# Altium schematic sheet Generic_555_Astable.SchDoc
size A
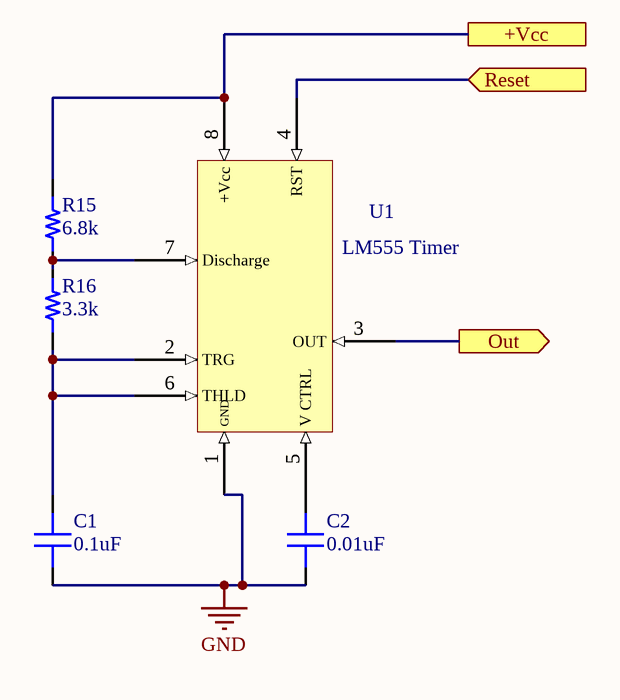
[diagram p0: Generic_555_Astable.SchDoc]

## Parts
C1  capacitance: 0.1uF  [0603]  (hidden comment: capacitor)
C2  capacitance: 0.01uF  [0603]  (hidden comment: capacitor)
R15  6.8k  [RES 0603/1608]
R16  3.3k  [RES 0603/1608]
U1  LM555 Timer  [SOIC-8]

## Ports
+Vcc, Out (out), Reset (in)

## Nets
GND: C1.1 C2.1 U1.1(GND)
+Vcc: R15.2 U1.8(+Vcc) ; port +Vcc
Out: U1.3(OUT) ; port Out
Reset: U1.4(RST) ; port Reset
NetC1_2: C1.2 R16.1 U1.2(TRG) U1.6(THLD)
NetC2_2: C2.2 U1.5(V_CTRL)
NetR15_1: R15.1 R16.2 U1.7(Discharge)

## Library data of the parts
C1 C2 = 1: Generic 0603 capacitor; id: 1; voltage: 50; dielectric: Ceramic; percent tolerance: 10; name: 0603 Capacitor; ESR: 1; package: 0603; quantity: 0
R15 R16 = 1: id: 1; name: 0603 Resistor; percent tolerance: 5; package: 0603; quantity: 0
  R15: resistance: 6.8k
  R16: resistance: 3.3k
U1 = 17: id: 17; quantity: 0